# Altium schematic sheet Sheet1.SchDoc
size A4
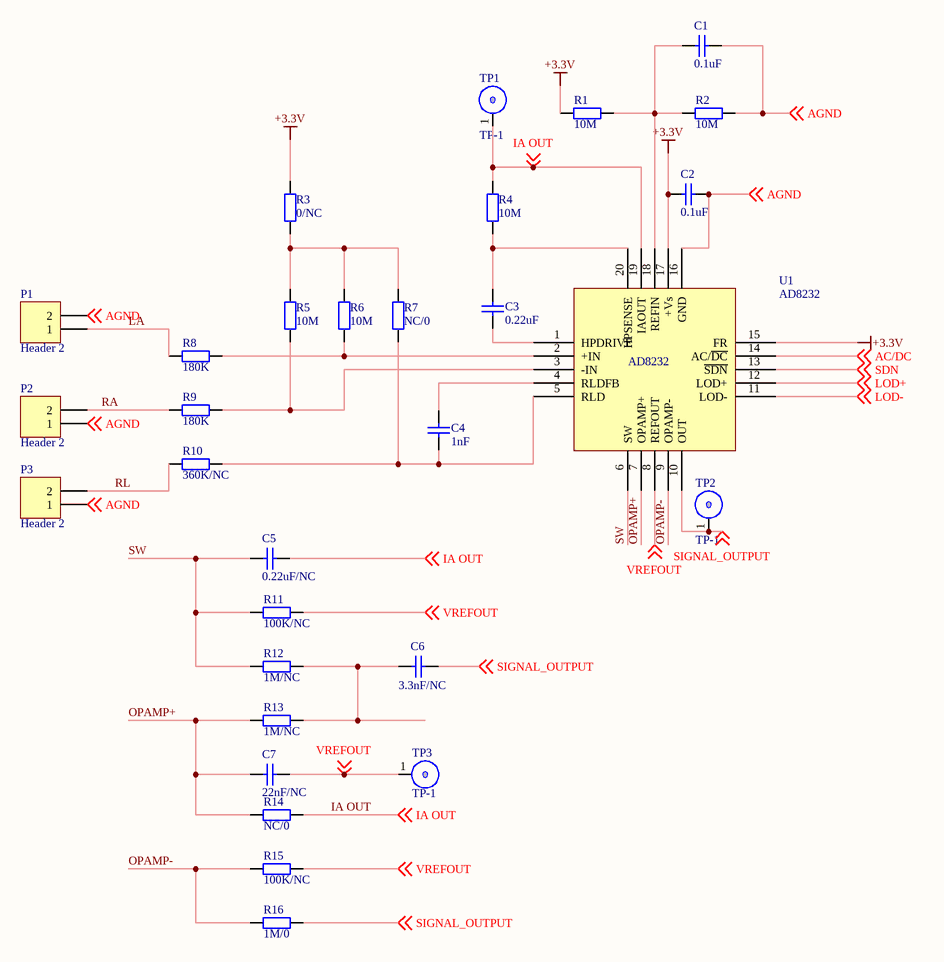
[diagram p0: Sheet1.SchDoc]

## Parts
C1  0.1uF  [0603C]
C2  0.1uF  [0603C]
C3  0.22uF  [0603C]
C4  1nF  [0603C]
C5  0.22uF/NC  [0603C]
C6  3.3nF/NC  [0603C]
C7  22nF/NC  [0603C]
P1  Header 2  [SIP2]
P2  Header 2  [SIP2]
P3  Header 2  [SIP2]
R1  10M  [0603R]
R2  10M  [0603R]
R3  0/NC  [0603R]
R4  10M  [0603R]
R5  10M  [0603R]
R6  10M  [0603R]
R7  NC/0  [0603R]
R8  180K  [0603R]
R9  180K  [0603R]
R10  360K/NC  [0603R]
R11  100K/NC  [0603R]
R12  1M/NC  [0603R]
R13  1M/NC  [0603R]
R14  NC/0  [0603R]
R15  100K/NC  [0603R]
R16  1M/0  [0603R]
TP1  TP-1  [tp-1-1]
TP2  TP-1  [tp-1-1]
TP3  TP-1  [tp-1-1]
U1  AD8232  [QFN-20]

## Nets
+3.3V: C2.2 R1.2 R3.2 U1.15(FR) U1.17(+Vs)
AC/DC: U1.14(AC/~{DC}) ; off-sheet AC/DC
AGND: C1.1 C2.1 P1.2 P2.1 P3.1 R2.1 U1.16(GND) ; off-sheet AGND
IA OUT: C5.2 R4.2 R14.2 TP1.1 U1.19(IAOUT) ; off-sheet IA OUT
LA: P1.1 R8.1
LOD+: U1.12(LOD+) ; off-sheet LOD+
LOD-: U1.11(LOD-) ; off-sheet LOD-
OPAMP+: C7.1 R13.1 R14.1 U1.7(OPAMP+)
OPAMP-: R15.1 R16.1 U1.9(OPAMP-)
RA: P2.2 R9.1
RL: P3.2 R10.1
SDN: U1.13(~{SDN}) ; off-sheet SDN
SIGNAL_OUTPUT: C6.2 R16.2 TP2.1 U1.10(OUT) ; off-sheet SIGNAL_OUTPUT
SW: C5.1 R11.1 R12.1 U1.6(SW)
VREFOUT: C7.2 R11.2 R15.2 TP3.1 U1.8(REFOUT) ; off-sheet VREFOUT
NetC1_2: C1.2 R1.1 R2.2 U1.18(REFIN)
NetC3_1: C3.1 U1.1(HPDRIVE)
NetC3_2: C3.2 R4.1 U1.20(HPSENSE)
NetC4_1: C4.1 R7.1 R10.2 U1.5(RLD)
NetC4_2: C4.2 U1.4(RLDFB)
NetC6_1: C6.1 R12.2 R13.2
NetR3_1: R3.1 R5.2 R6.2 R7.2
NetR5_1: R5.1 R9.2 U1.3(-IN)
NetR6_1: R6.1 R8.2 U1.2(+IN)

## Library data of the parts
C1-C7 = Cap: Capacitor; Value: 4700pF; Published: 8-Jun-2000; LatestRevisionDate: 17-Jul-2002; LatestRevisionNote: Re-released for DXP Platform.; PackageReference: RAD-0.3; Publisher: Altium Limited; PackageDescription: Radial Cap, Thru-Hole; 2 Leads; 0.3 in Pin Spacing
P1-P3 = Header 2: Header, 2-Pin; LatestRevisionDate: 17-Jul-2002; LatestRevisionNote: Re-released for DXP Platform.; Publisher: Altium Limited
R1-R16 = Res2: Resistor; Value: 50K; Published: 8-Jun-2000; LatestRevisionDate: 17-Jul-2002; LatestRevisionNote: Re-released for DXP Platform.; PackageReference: AXIAL-0.4; Publisher: Altium Limited; PackageDescription: Axial Device, Thru-Hole; 2 Leads; 0.4 in Pin Spacing